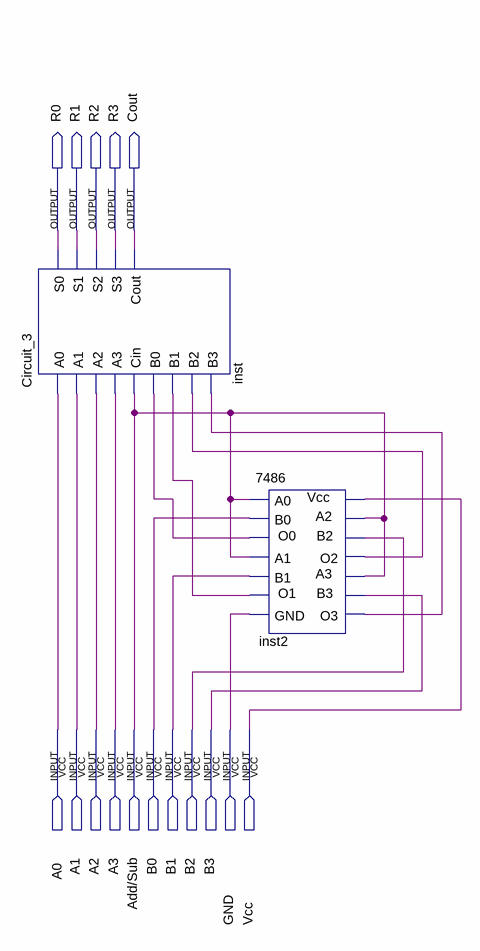
[diagram p0: schematic sheet]
// Quartus schematic Adder_Subtractor.bdf as structural Verilog: 2 symbols, 16 pins
module Adder_Subtractor (
  input  A0,
  input  A1,
  input  A2,
  input  A3,
  input  \Add/Sub ,
  input  B0,
  input  B1,
  input  B2,
  input  B3,
  input  GND,
  input  Vcc,
  output R0,
  output R1,
  output R2,
  output R3,
  output Cout
);

  wire inst2_o0, inst2_o1, inst2_o2, inst2_o3;

  Circuit_3 inst (
    .A0(A0), .B0(inst2_o0), .A1(A1), .B1(inst2_o1), .A2(A2), .B2(inst2_o2), .A3(A3), .B3(inst2_o3),
    .Cin(\Add/Sub ), .S0(R0), .S1(R1), .S2(R2), .S3(R3), .Cout(Cout));
  \7486  inst2 (
    .Vcc(Vcc), .A0(\Add/Sub ), .B0(B0), .A1(\Add/Sub ), .B1(B1), .A2(\Add/Sub ), .B2(B2), .A3(\Add/Sub ),
    .B3(B3), .GND(GND), .O0(inst2_o0), .O1(inst2_o1), .O2(inst2_o2), .O3(inst2_o3));
endmodule
